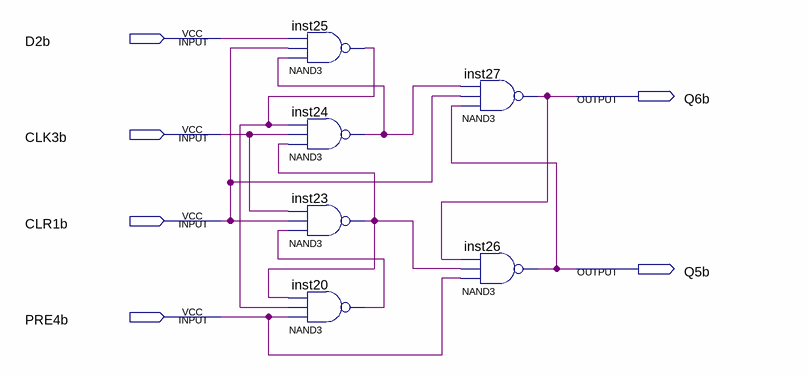
[diagram p0: schematic sheet]
// Quartus schematic 74LS74b_1.bdf as structural Verilog: 6 symbols, 6 pins
module \74LS74b_1  (
  input  D2b,
  input  CLK3b,
  input  CLR1b,
  input  PRE4b,
  output Q6b,
  output Q5b
);

  wire inst20_out, inst23_out, inst24_out, inst25_out;

  nand inst25 (inst25_out, inst24_out, CLR1b, D2b);
  nand inst24 (inst24_out, inst23_out, CLK3b, inst25_out);
  nand inst23 (inst23_out, inst20_out, CLR1b, CLK3b);
  nand inst20 (inst20_out, PRE4b, inst25_out, inst23_out);
  nand inst27 (Q6b, Q5b, CLR1b, inst24_out);
  nand inst26 (Q5b, PRE4b, inst23_out, Q6b);
endmodule
